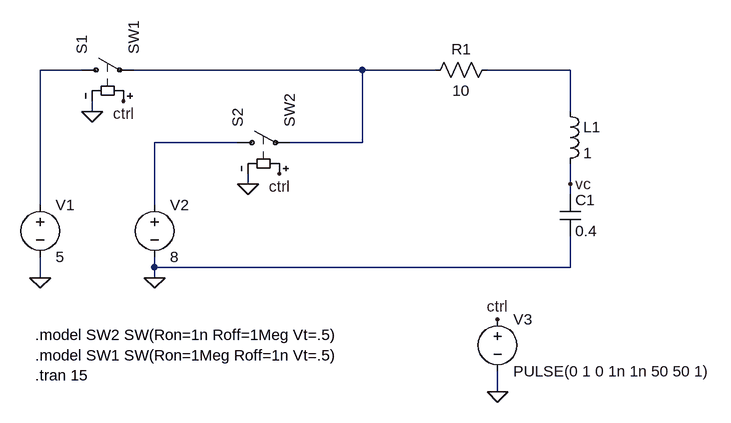
[diagram p0: schematic CH04-KP2-01.asc]
CH04-KP2-01.asc, the LTspice schematic file:
Version 4
SHEET 1 992 680
WIRE 16 144 -48 144
WIRE 448 144 96 144
WIRE 560 144 448 144
WIRE 768 144 640 144
WIRE 32 208 32 192
WIRE 768 208 768 144
WIRE 256 256 128 256
WIRE 448 256 448 144
WIRE 448 256 336 256
WIRE 272 320 272 304
WIRE 768 320 768 288
WIRE 768 336 768 320
WIRE -48 352 -48 144
WIRE 128 352 128 256
WIRE 128 448 128 432
WIRE 768 448 768 400
WIRE 768 448 128 448
WIRE -48 464 -48 432
WIRE 128 464 128 448
WIRE 656 640 656 608
FLAG 656 640 0
FLAG 128 464 0
FLAG -48 464 0
FLAG 32 208 0
FLAG 272 320 0
FLAG 656 528 ctrl
FLAG 80 192 ctrl
FLAG 320 304 ctrl
FLAG 768 320 vc
SYMBOL voltage -48 336 R0
SYMATTR InstName V1
SYMATTR Value 5
SYMBOL voltage 128 336 R0
SYMATTR InstName V2
SYMATTR Value 8
SYMBOL sw 0 144 R270
SYMATTR InstName S1
SYMATTR Value SW1
SYMBOL sw 240 256 R270
SYMATTR InstName S2
SYMATTR Value SW2
SYMBOL voltage 656 512 R0
SYMATTR InstName V3
SYMATTR Value PULSE(0 1 0 1n 1n 50 50 1)
SYMBOL res 656 128 R90
WINDOW 0 0 56 VBottom 2
WINDOW 3 32 56 VTop 2
SYMATTR InstName R1
SYMATTR Value 10
SYMBOL ind 752 192 R0
SYMATTR InstName L1
SYMATTR Value 1
SYMATTR SpiceLine Rser=0
SYMBOL cap 752 336 R0
SYMATTR InstName C1
SYMATTR Value 0.4
TEXT -56 552 Left 2 !.model SW2 SW(Ron=1n Roff=1Meg Vt=.5)\n.model SW1 SW(Ron=1Meg Roff=1n Vt=.5)\n.tran 15

The netlist it stands for:
* CH04-KP2-01.asc
V1 N001 0 5
V2 N004 0 8
S1 N001 N002 ctrl 0 SW1
S2 N004 N002 ctrl 0 SW2
V3 ctrl 0 PULSE(0 1 0 1n 1n 50 50 1)
R1 N003 N002 10
L1 N003 vc 1 Rser=0
C1 vc 0 0.4
.model SW2 SW(Ron=1n Roff=1Meg Vt=.5)
.model SW1 SW(Ron=1Meg Roff=1n Vt=.5)
.tran 15
.backanno
.end